# Altium schematic sheet Sheet2.SchDoc: Heart Circuit
size A; Date: 5/3/2024; DrawnBy: Nhi Le; Organization: Pay It Forward Club; Address3: HCMC; DocumentNumber: 1; Revision: 1; SheetNumber: 1; SheetTotal: 1; Time: 11:25:12 AM
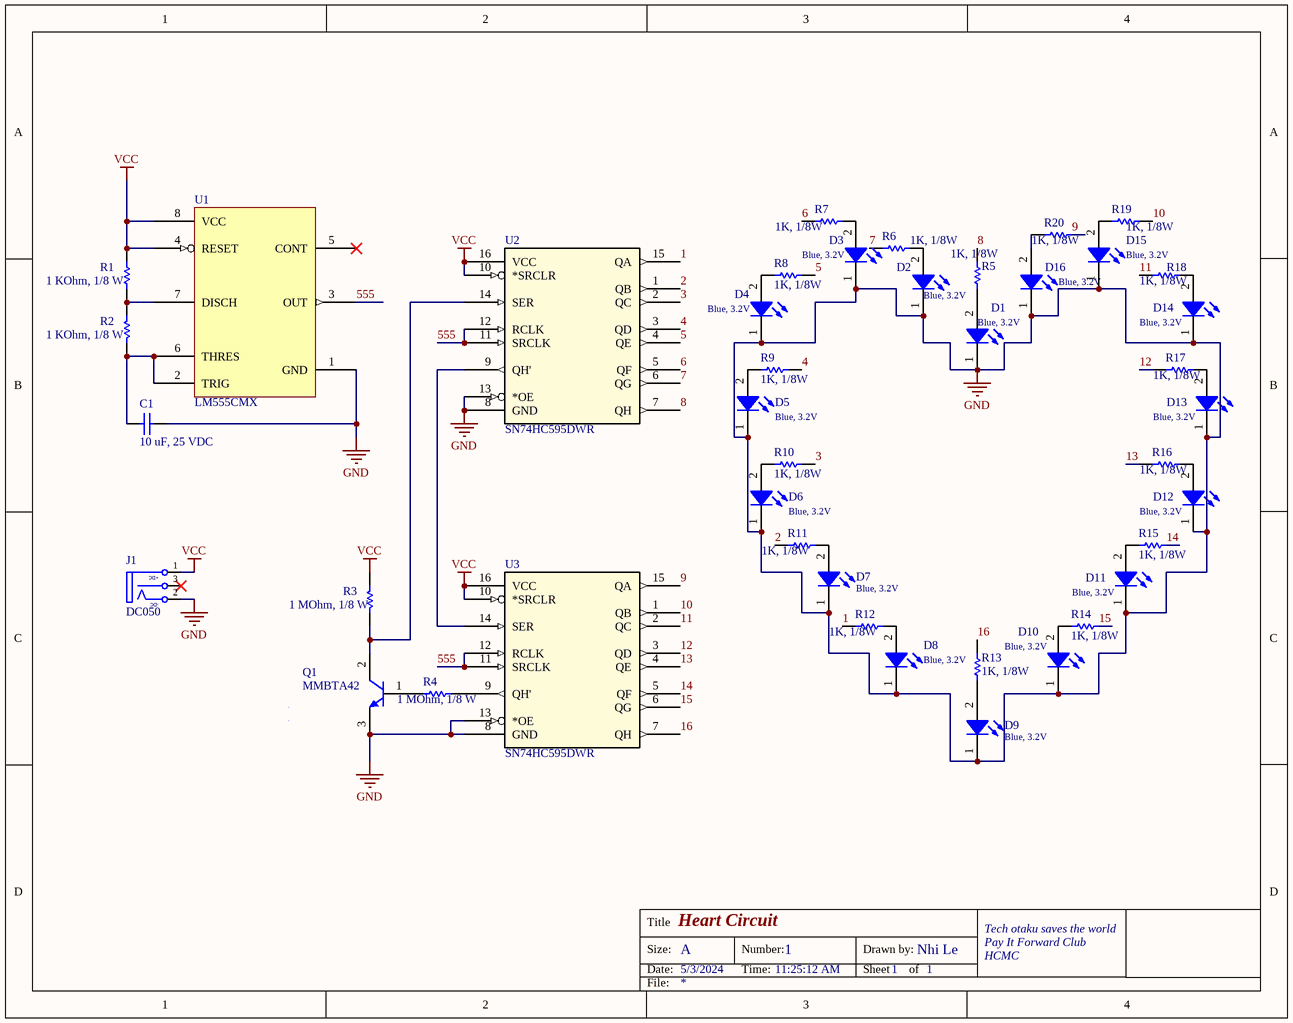
[diagram p0: Sheet2.SchDoc]

## Parts
C1  10 uF, 25 VDC  [CAP_0805]
D1  Blue, 3.2V  [WL-SMCW_0805]
D2  Blue, 3.2V  [WL-SMCW_0805]
D3  Blue, 3.2V  [WL-SMCW_0805]
D4  Blue, 3.2V  [WL-SMCW_0805]
D5  Blue, 3.2V  [WL-SMCW_0805]
D6  Blue, 3.2V  [WL-SMCW_0805]
D7  Blue, 3.2V  [WL-SMCW_0805]
D8  Blue, 3.2V  [WL-SMCW_0805]
D9  Blue, 3.2V  [WL-SMCW_0805]
D10  Blue, 3.2V  [WL-SMCW_0805]
D11  Blue, 3.2V  [WL-SMCW_0805]
D12  Blue, 3.2V  [WL-SMCW_0805]
D13  Blue, 3.2V  [WL-SMCW_0805]
D14  Blue, 3.2V  [WL-SMCW_0805]
D15  Blue, 3.2V  [WL-SMCW_0805]
D16  Blue, 3.2V  [WL-SMCW_0805]
J1  DC050  [DC050]
Q1  MMBTA42  [MMBT-SOT23]
R1  1 KOhm, 1/8 W  [RESISTOR_0805]
R2  1 KOhm, 1/8 W  [RESISTOR_0805]
R3  1 MOhm, 1/8 W  [RESISTOR_0805]
R4  1 MOhm, 1/8 W  [RESISTOR_0805]
R5  1K, 1/8W  [RESISTOR_0805]
R6  1K, 1/8W  [RESISTOR_0805]
R7  1K, 1/8W  [RESISTOR_0805]
R8  1K, 1/8W  [RESISTOR_0805]
R9  1K, 1/8W  [RESISTOR_0805]
R10  1K, 1/8W  [RESISTOR_0805]
R11  1K, 1/8W  [RESISTOR_0805]
R12  1K, 1/8W  [RESISTOR_0805]
R13  1K, 1/8W  [RESISTOR_0805]
R14  1K, 1/8W  [RESISTOR_0805]
R15  1K, 1/8W  [RESISTOR_0805]
R16  1K, 1/8W  [RESISTOR_0805]
R17  1K, 1/8W  [RESISTOR_0805]
R18  1K, 1/8W  [RESISTOR_0805]
R19  1K, 1/8W  [RESISTOR_0805]
R20  1K, 1/8W  [RESISTOR_0805]
U1  LM555CMX  [LM555CMX]
U2  SN74HC595DWR  [DW16]
U3  SN74HC595DWR  [DW16]

## Nets
GND: C1.2 D1.1(K) D2.1(K) D3.1(K) D4.1(K) D5.1(K) D6.1(K) D7.1(K) D8.1(K) D9.1(K) D10.1(K) D11.1(K) D12.1(K) D13.1(K) D14.1(K) D15.1(K) D16.1(K) J1.2(TN) Q1.3(E) U1.1(GND) U2.8(GND) U2.13(*OE) U3.8(GND) U3.13(*OE)
VCC: J1.1(T) R1.2 R3.2 U1.4(RESET) U1.8(VCC) U2.10(*SRCLR) U2.16(VCC) U3.10(*SRCLR) U3.16(VCC)
1: R12.2 U2.15(QA)
2: R11.2 U2.1(QB)
3: R10.2 U2.2(QC)
4: R9.2 U2.3(QD)
5: R8.2 U2.4(QE)
6: R7.2 U2.5(QF)
7: R6.2 U2.6(QG)
8: R5.1 U2.7(QH)
9: R20.2 U3.15(QA)
10: R19.2 U3.1(QB)
11: R18.2 U3.2(QC)
12: R17.2 U3.3(QD)
13: R16.2 U3.4(QE)
14: R15.2 U3.5(QF)
15: R14.2 U3.6(QG)
16: R13.2 U3.7(QH)
555: U1.3(OUT) U2.11(SRCLK) U2.12(RCLK) U3.11(SRCLK) U3.12(RCLK)
NetC1_1: C1.1 R2.1 U1.2(TRIG) U1.6(THRES)
NetD1_2: D1.2(A) R5.2
NetD2_2: D2.2(A) R6.1
NetD3_2: D3.2(A) R7.1
NetD4_2: D4.2(A) R8.1
NetD5_2: D5.2(A) R9.1
NetD6_2: D6.2(A) R10.1
NetD7_2: D7.2(A) R11.1
NetD8_2: D8.2(A) R12.1
NetD9_2: D9.2(A) R13.1
NetD10_2: D10.2(A) R14.1
NetD11_2: D11.2(A) R15.1
NetD12_2: D12.2(A) R16.1
NetD13_2: D13.2(A) R17.1
NetD14_2: D14.2(A) R18.1
NetD15_2: D15.2(A) R19.1
NetD16_2: D16.2(A) R20.1
NetQ1_1: Q1.1(B) R4.1
NetQ1_2: Q1.2(C) R3.1 U2.14(SER)
NetR1_1: R1.1 R2.2 U1.7(DISCH)
NetR4_2: R4.2 U3.9(QH')
NetU2_9: U2.9(QH') U3.14(SER)

Not connected (* = marked no-connect by the designer): J1 3(S)*; U1 5(CONT)*

## Notes on the sheet
- Title
- Size:
- Date:
- A
- Number:
- Time:
- Drawn by:
- Sheet
- of
- Tech otaku saves the world
- File:
- (in symbol DC050) +DC; -DC

## Library data of the parts
C1 = 0108051061025: CAP, size 0805, 10 uF, 25 VDC; Manufacture Name: TDK; Manufacture SN: CGA4J1X7S1E106K125AE; Capacitance: 10 uF; Tolerance: +/-10%; Voltage Rating DC: 25 VDC; ComponentLink2Description: Datasheet; ComponentLink2URL: https://product.tdk.com/system/files/dam/doc/product/capacitor/ceramic/mlcc/catalog/mlcc_automotive_soft_en.pdf?ref_disty=mouser; Operating Temperature: -55 to +125degC; Packaging: Tape and Reel; Mounting Technology: SMT; Size: 0805; Supplier 1 Name: Mouser; Supplier 1 SN: 810-CGA4J1X7S1E106K2; Supplier 1 URL: https://www.mouser.vn/ProductDetail/TDK/CGA4J1X7S1E106K125AE?qs=PqoDHHvF64%252BJvhmUzM2odA%3D%3D&utm_source=mouser-refine-download&utm_medium=file&utm_campaign=CGA4J1X7S1E106K125AE&utm_content=TDK; Supplier 2 Name: Digi-Key; Supplier 2 SN: 445-181411-2-ND; Supplier 2 URL: https://www.digikey.com/en/products/detail/tdk-corporation/cga4j1x7s1e106k125ae/9744777; Supplier 3 Name: thegioiic; Supplier 3 SN: OEM; Supplier 3 URL: N/A; Value: 10 uF, 25 VDC
D1-D16 = 160805BlueClear: WL-SMCW SMT Mono-color Chip LED Waterclear, size 0805, Blue, 3.2V, 140deg; Type: Clear; Color: Blue; Size: 0603; ComponentLink1Description: Datasheet link; ComponentLink1URL: N/A; ComponentLink2Description: Supplier 1 URL; ComponentLink2URL: https://www.mouser.vn/ProductDetail/Wurth-Elektronik/150080BS75000?qs=2kOmHSv6VfT2tBo3UPVqAQ%3D%3D; ComponentLink3Description: Supplier 2 URL; ComponentLink3URL: https://www.digikey.com/en/products/detail/liteon/LTST-C170TBKT/388527; ComponentLink4Description: Supplier 3 URL; ComponentLink4URL: https://www.thegioiic.com/led-xanh-duong-0805-dan-smd-trong-suot-harvatek; Supplier 1 Name: Mouser; Supplier 1 SN: 710-150080BS75000; Supplier 1 URL: https://www.mouser.vn/ProductDetail/Wurth-Elektronik/150080BS75000?qs=2kOmHSv6VfT2tBo3UPVqAQ%3D%3D; Supplier 2 Name: Digi-Key; Supplier 2 SN: 160-1579-2-ND; Supplier 2 URL: https://www.digikey.com/en/products/detail/liteon/LTST-C170TBKT/388527; Supplier 3 Name: ICDayRoi; Supplier 3 SN: N/A; Supplier 3 URL: https://www.thegioiic.com/led-xanh-duong-0805-dan-smd-trong-suot-harvatek; Value: Blue, 3.2V
J1 = DC050: Manufacturer: OEM; Rated Current: 2.5A; Working Voltage: 16V; ComponentLink1Description: Datasheet link; ComponentLink1URL: N/A; ComponentLink2Description: Supplier 1 URL; ComponentLink2URL: N/A; ComponentLink3Description: Supplier 2 URL; ComponentLink3URL: N/A; ComponentLink4Description: Supplier 3 URL; ComponentLink4URL: https://www.thegioiic.com/dc050-dau-noi-nguon-dc-cai-5521-dan-smd-kim-2-1mm; Manufacturer Part Number: N/A; Mount: SMD; Number of Pins: 4; Operating Temperature Max: N/A; Operating Temperature Min: N/A; Orientation: N/A; Packaging: N/A; Supplier 1 Name: Mouser; Supplier 1 SN: N/A; Supplier 1 URL: N/A; Supplier 2 Name: Digi-Key; Supplier 2 SN: N/A; Supplier 2 URL: N/A; Supplier 3 Name: thegioiic; Supplier 3 SN: DC050; Supplier 3 URL: https://www.thegioiic.com/dc050-dau-noi-nguon-dc-cai-5521-dan-smd-kim-2-1mm; Value: DC050
Q1 = MMBTA42: TRANS NPN, 300V, 0.5A, SOT23-3; Current - Collector: 500mA; DC Current Gain: 80-200; Power Dissipation: 250mW; Gain Bandwidth Product fT: 50MHz; Voltage - Collector Emitter Breakdown: 300V; Transistor Type: NPN; Package: SOT-23; Supplier 1 Name: Mouser; Supplier 1 SN: 637-MMBTA42; Supplier 1 URL: https://www.mouser.vn/ProductDetail/Diotec-Semiconductor/MMBTA42?qs=OlC7AqGiEDkTSphcOD18pw%3D%3D; Supplier 2 Name: Digi-Key; Supplier 2 SN: 2796-MMBTA42TR-ND; Supplier 2 URL: https://www.digikey.com/en/products/detail/diotec-semiconductor/MMBTA42/13163233; Supplier 3 Name: thegioiic; Supplier 3 SN: N/A; Supplier 3 URL: https://www.thegioiic.com/mmbta42-transistor-npn-300v-0-5a-3-chan-sot-23; Value: MMBTA42
R1 R2 = 0008051021: RES, size 0805, 1 KOhm, 1/8 W; Manufacture  Name: Vishay Dale; Manufacture  SN: M55342K06B1E00RS3; Resistance tolerance: +/-1%; Rated Power: 1/8 W; Resistance: 1 KOhm; Size: 0805; Mounting Technology: SMT; Supplier 1 Name: Mouser; Supplier 1 SN: N/A; Supplier 1 URL: N/A; Supplier 2 Name: Digi-Key; Supplier 2 SN: 1135-1001-2-ND; Supplier 2 URL: https://www.digikey.com/en/products/detail/vishay-dale/M55342K06B1E00RS3/2941798; Supplier 3 Name: Thegioiic; Supplier 3 SN: N/A; Supplier 3 URL: https://www.thegioiic.com/dien-tro-1-kohm-0805-1; Value: 1 KOhm, 1/8 W; ComponentLink1Description: Datasheet link; ComponentLink1URL: https://www.vishay.com/docs/31010/rcwpm.pdf; ComponentLink2Description: Supplier 1 URL; ComponentLink2URL: N/A; ComponentLink3Description: Supplier 2 URL; ComponentLink3URL: https://www.digikey.com/en/products/detail/vishay-dale/M55342K06B1E00RS3/2941798; ComponentLink4Description: Supplier 3 URL; ComponentLink4URL: https://www.thegioiic.com/dien-tro-1-kohm-0805-1
R3 R4 = 0008051051: RES, size 0805, 1 MOhm, 1/8 W; Manufacture  Name: Vishay Dale; Manufacture  SN: M55342K06B1F00RS3; Resistance tolerance: +/-1%; Rated Power: 1/8 W; Resistance: 1 MOhm; Size: 0805; Mounting Technology: SMT; Supplier 1 Name: Mouser; Supplier 1 SN: N/A; Supplier 1 URL: N/A; Supplier 2 Name: Digi-Key; Supplier 2 SN: 1135-1009-2-ND; Supplier 2 URL: https://www.digikey.com/en/products/detail/vishay-dale/M55342K06B1F00RS3/2941807?s=N4IgjCBcoMxaBjKAzAhgGwM4FMA0IB7KAbXDBggF18AHAFyhAGU6AnASwDsBzEAX3xgAbPBBJIaLHkIkQMAJwwATPJDUQ9Riw49%2B%2BACwjoYlBhz4ikUgA4A7MrW0GkZmy68BIJQAZrAVlFxSXMZK3AAAgBZAHkACwBbTEcNZxAAVU52OmjkSOxUTABXVmx%2BPj4gA; Supplier 3 Name: Thegioiic; Supplier 3 SN: N/A; Supplier 3 URL: https://www.thegioiic.com/dien-tro-1-mohm-0805-1; Value: 1 MOhm, 1/8 W; ComponentLink1Description: Datasheet link; ComponentLink1URL: N/A; ComponentLink2Description: Supplier 1 URL; ComponentLink2URL: N/A; ComponentLink3Description: Supplier 2 URL; ComponentLink3URL: https://www.digikey.com/en/products/detail/vishay-dale/M55342K06B1F00RS3/2941807?s=N4IgjCBcoMxaBjKAzAhgGwM4FMA0IB7KAbXDBggF18AHAFyhAGU6AnASwDsBzEAX3xgAbPBBJIaLHkIkQMAJwwATPJDUQ9Riw49%2B%2BACwjoYlBhz4ikUgA4A7MrW0GkZmy68BIJQAZrAVlFxSXMZK3AAAgBZAHkACwBbTEcNZxAAVU52OmjkSOxUTABXVmx%2BPj4gA; ComponentLink4Description: Supplier 3 URL; ComponentLink4URL: https://www.thegioiic.com/dien-tro-1-mohm-0805-1
R5-R20 = 0008051021: RES, size 0805, 1 KOhm, 1/8 W; Manufacture  Name: Vishay Dale; Manufacture  SN: M55342K06B1E00RS3; Resistance tolerance: +/-1%; Resistance: 1 KOhm; Size: 0805; Mounting Technology: SMT; Rated Power: 1/8 W; Supplier 1 Name: Mouser; Supplier 1 SN: N/A; Supplier 1 URL: N/A; Supplier 2 Name: Digi-Key; Supplier 2 SN: 1135-1001-2-ND; Supplier 2 URL: https://www.digikey.com/en/products/detail/vishay-dale/M55342K06B1E00RS3/2941798; Supplier 3 Name: Thegioiic; Supplier 3 SN: N/A; Supplier 3 URL: https://www.thegioiic.com/dien-tro-1-kohm-0805-1; Value: 1 KOhm, 1/8 W; ComponentLink1Description: Datasheet link; ComponentLink1URL: https://www.vishay.com/docs/31010/rcwpm.pdf; ComponentLink2Description: Supplier 1 URL; ComponentLink2URL: N/A; ComponentLink3Description: Supplier 2 URL; ComponentLink3URL: https://www.digikey.com/en/products/detail/vishay-dale/M55342K06B1E00RS3/2941798; ComponentLink4Description: Supplier 3 URL; ComponentLink4URL: https://www.thegioiic.com/dien-tro-1-kohm-0805-1
U1 = LM555CMX: Timers & Support Products TIMER; Manufacturer: Texas Instruments; Manufacturer Part Number: LM555CMX/NOPB; Pad count: 8; Supply Voltage - Max: 4.5 V; Supply Voltage - Min: 16 V; Number of Internal Timers: 1; Power Dissipation: 1.18 W; Active: Active; ComponentLink1Description: Datasheet; ComponentLink1URL: https://www.ti.com/lit/gpn/lm555; LCSC Part #: N/A; Mount: SMD/SMT; Operating Temperature Max: + 85 C; Operating Temperature Min: - 40 C; Package / Case: SOIC-8; Packaging: Tape and Reel; Supplier 1: Mouser; Supplier 1 Part Number: 926-LM555CMX/NOPB; Supplier 1 URL: https://www.mouser.com/ProductDetail/Texas-Instruments/LM555CMX-NOPB?qs=QbsRYf82W3GHnQuoL%2FmIoA%3D%3D; Supplier 2: Digi-Key; Supplier 2 Part Number: N/A; Supplier 2 URL: N/A; Supplier 3: thegioiic; Supplier 3 Part Number: NE555D; Supplier 3 URL: https://www.thegioiic.com/ne555d-ic-timer-circuit-100khz-8-soic; Value: LM555CMX
U2 U3 = SN74HC595DWR: No Description Available; Mfr_Name: Texas Instruments; RefDes: RefDes; Type: Type